# EAGLE schematic iot_demo_mote (EAGLE 6.5.0)
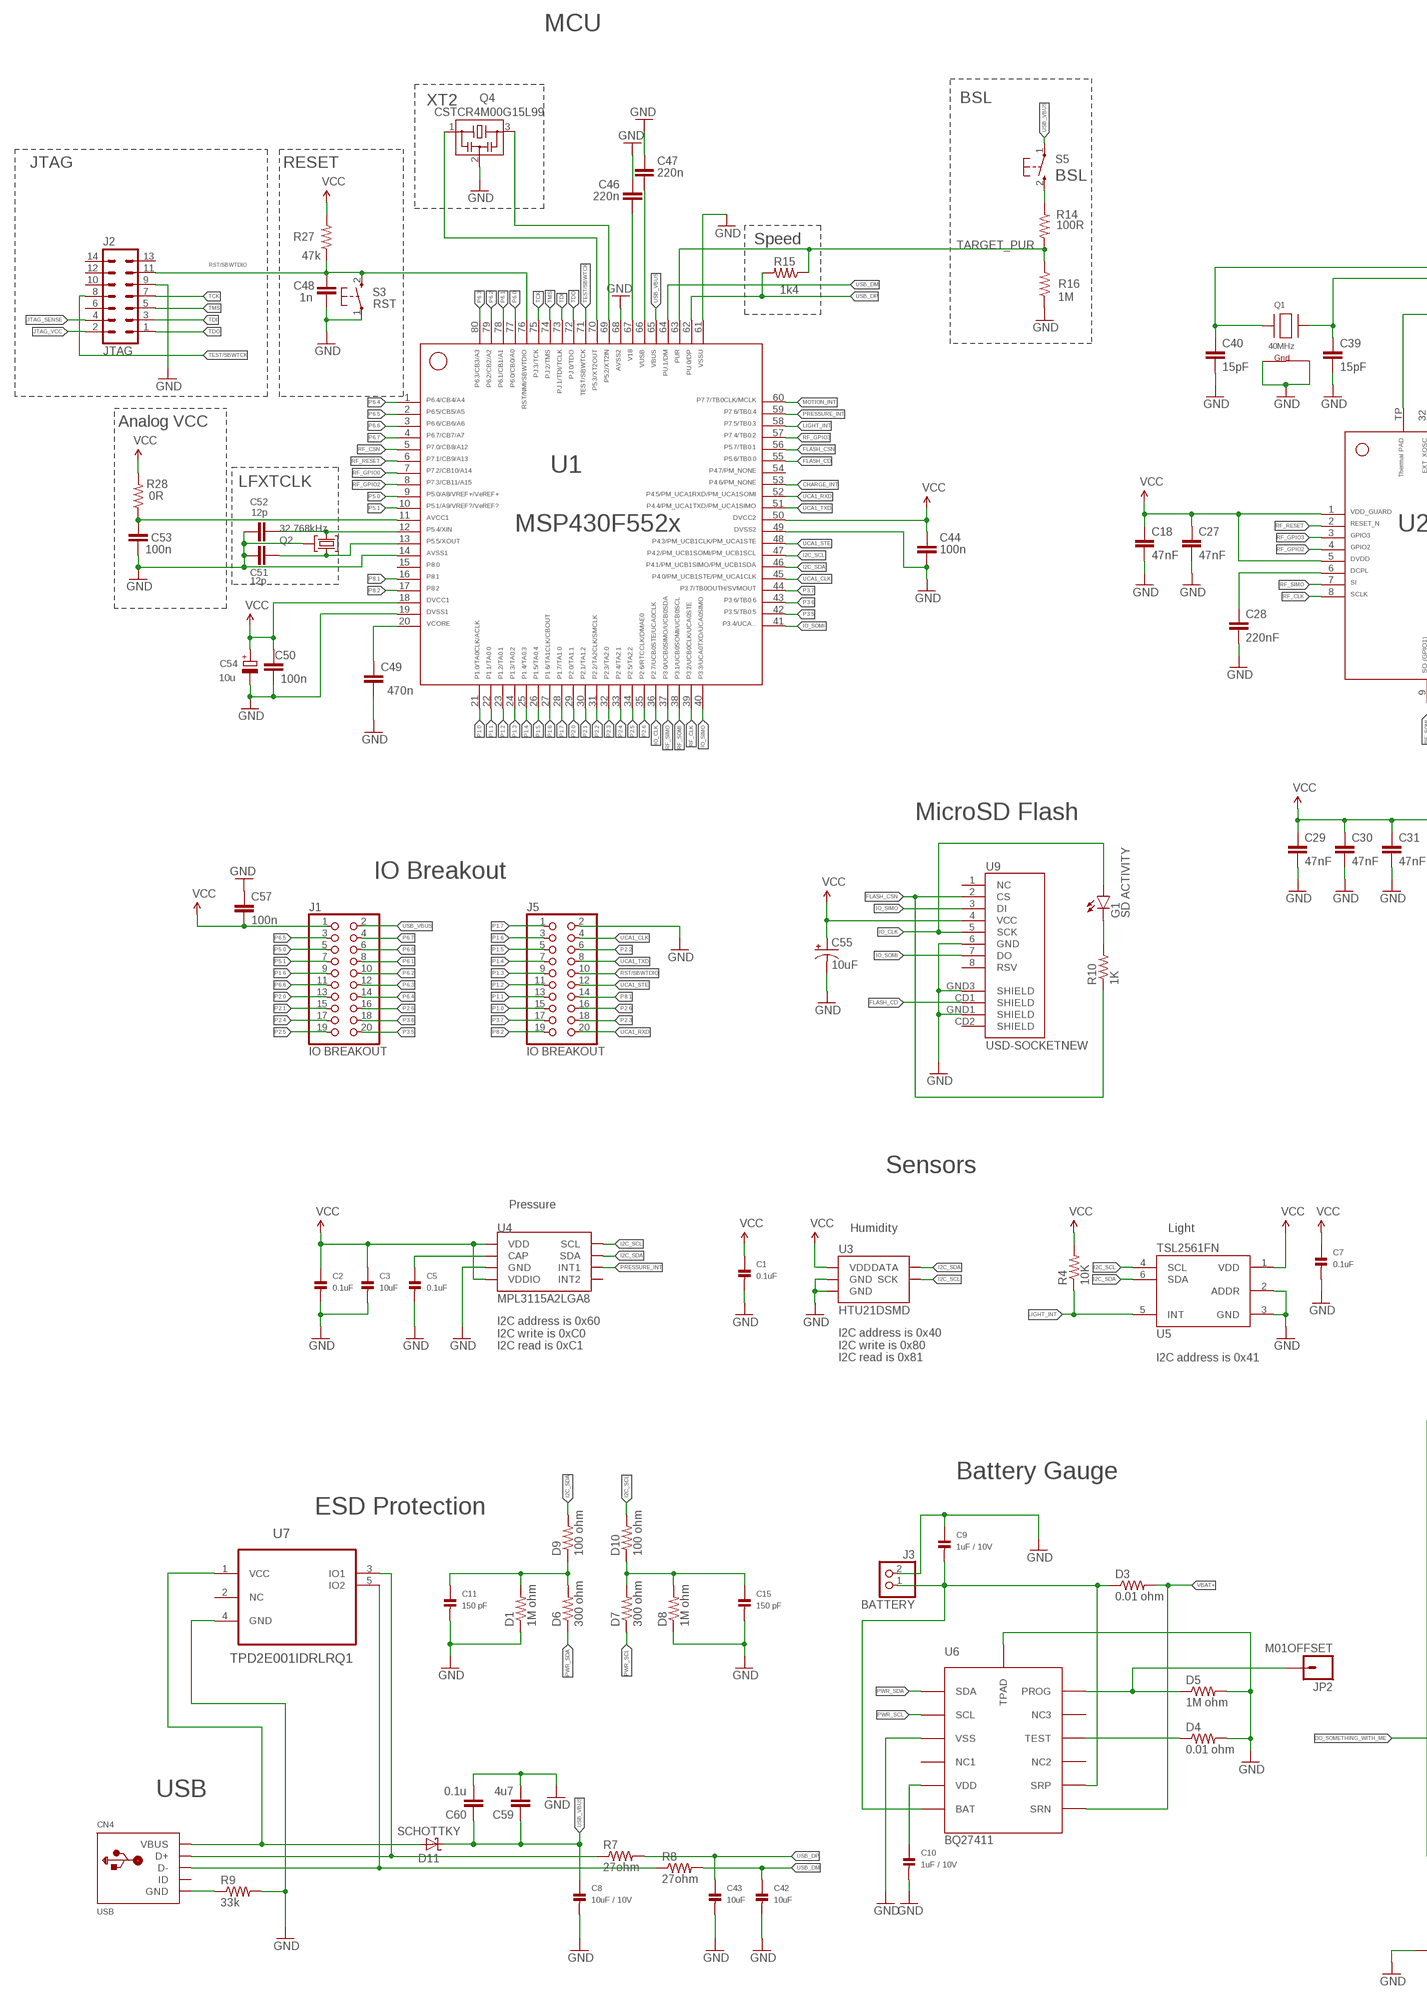
[diagram p0: schematic, sheet 1, part 1 of 2]
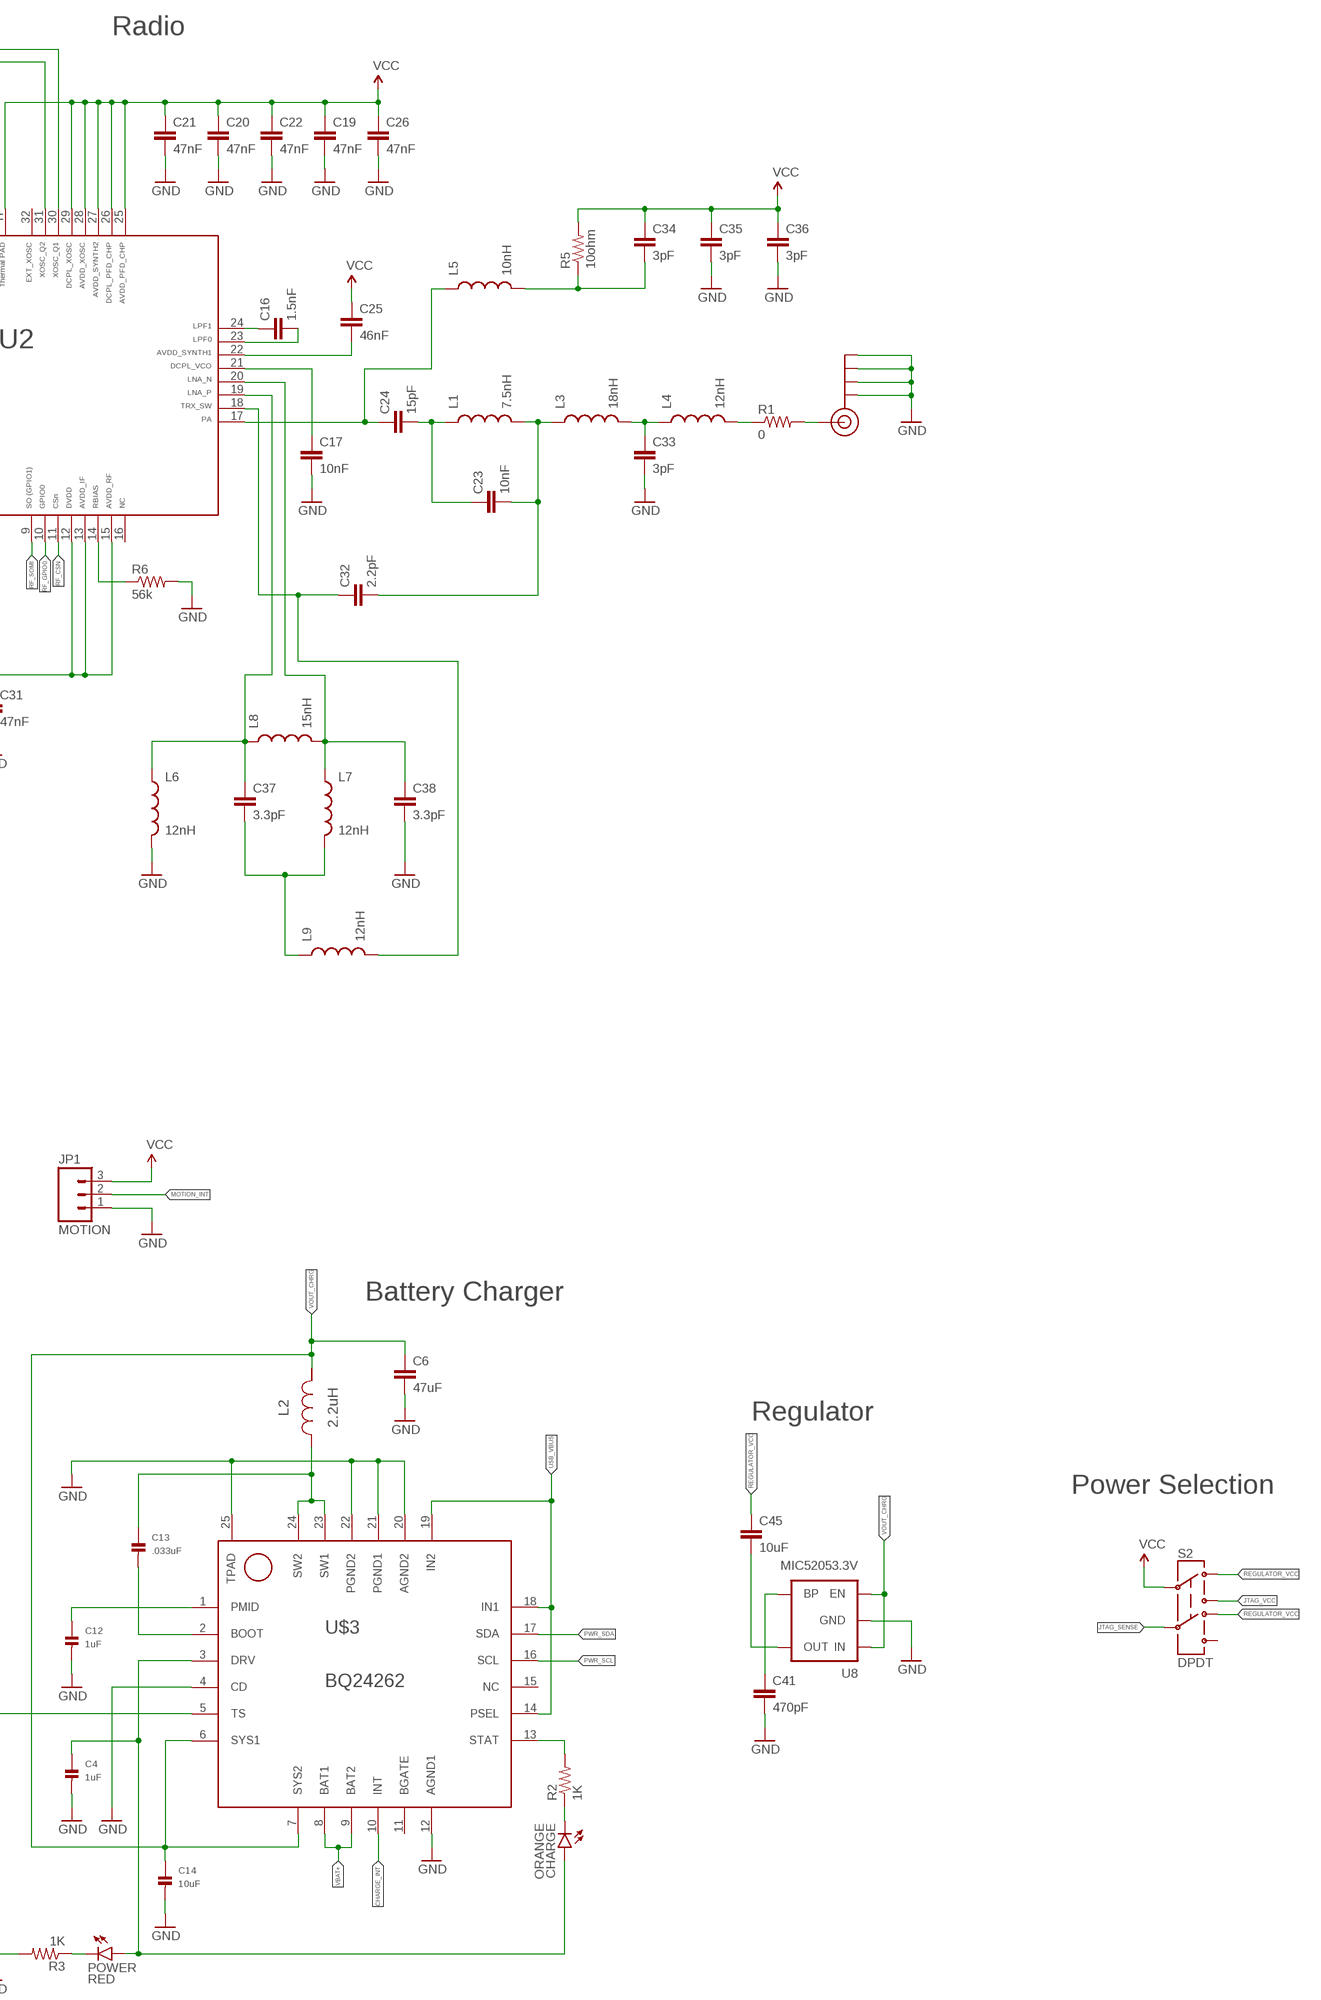
[diagram p1: schematic, sheet 1, part 2 of 2]

## Parts
C1  0.1uF  CAP_CERAMIC0603  [0603]
C2  0.1uF  CAP_CERAMIC0603  [0603]
C3  10uF  CAP_CERAMIC0603  [0603]
C4  1uF  CAP_CERAMIC0603  [0603]
C5  0.1uF  CAP_CERAMIC0603  [0603]
C6  47uF  CAP0402-CAP  [0402-CAP]
C7  0.1uF  CAP_CERAMIC0603  [0603]
C8  10uF / 10V  CAP_CERAMIC0603  [0603]
C9  1uF / 10V  CAP_CERAMIC0603  [0603]
C10  1uF / 10V  CAP_CERAMIC0603  [0603]
C11  150 pF  CAP_CERAMIC0603  [0603]
C12  1uF  CAP_CERAMIC0603  [0603]
C13  .033uF  CAP_CERAMIC0603  [0603]
C14  10uF  CAP_CERAMIC0603  [0603]
C15  150 pF  CAP_CERAMIC0603  [0603]
C16  1.5nF  CAP0402-CAP  [0402-CAP]
C17  10nF  CAP0402-CAP  [0402-CAP]
C18  47nF  CAP0402-CAP  [0402-CAP]
C19  47nF  CAP0402-CAP  [0402-CAP]
C20  47nF  CAP0402-CAP  [0402-CAP]
C21  47nF  CAP0402-CAP  [0402-CAP]
C22  47nF  CAP0402-CAP  [0402-CAP]
C23  10nF  CAP0402-CAP  [0402-CAP]
C24  15pF  CAP0402-CAP  [0402-CAP]
C25  46nF  CAP0402-CAP  [0402-CAP]
C26  47nF  CAP0402-CAP  [0402-CAP]
C27  47nF  CAP0402-CAP  [0402-CAP]
C28  220nF  CAP0402-CAP  [0402-CAP]
C29  47nF  CAP0402-CAP  [0402-CAP]
C30  47nF  CAP0402-CAP  [0402-CAP]
C31  47nF  CAP0402-CAP  [0402-CAP]
C32  2.2pF  CAP0402-CAP  [0402-CAP]
C33  3pF  CAP0402-CAP  [0402-CAP]
C34  3pF  CAP0402-CAP  [0402-CAP]
C35  3pF  CAP0402-CAP  [0402-CAP]
C36  3pF  CAP0402-CAP  [0402-CAP]
C37  3.3pF  CAP0402-CAP  [0402-CAP]
C38  3.3pF  CAP0402-CAP  [0402-CAP]
C39  15pF  CAP0402-CAP  [0402-CAP]
C40  15pF  CAP0402-CAP  [0402-CAP]
C41  470pF  CAP0402-CAP  [0402-CAP]
C42  10uF  CAP_CERAMIC0603  [0603]
C43  10uF  CAP_CERAMIC0603  [0603]
C44  100n  C-EUC0402  [C0402]
C45  10uF  CAP0402-CAP  [0402-CAP]
C46  220n  C-EUC0402  [C0402]
C47  220n  C-EUC0402  [C0402]
C48  1n  C-EUC0402  [C0402]
C49  470n  C-EUC0402  [C0402]
C50  100n  C-EUC0402  [C0402]
C51  12p  C-EUC0402  [C0402]
C52  12p  C-EUC0402  [C0402]
C53  100n  C-EUC0402  [C0402]
C54  10u  CPOL-EUA/3216-18R  [A/3216-18R]
C55  10uF  CPOL-USA/3216-18R  [A/3216-18R]
C57  100n  C-EUC0402  [C0402]
C59  4u7  C-EUC0603  [C0603]
C60  0.1u  C-EUC0603  [C0603]
CHARGE  ORANGE  LED0603  [LED-0603]
CN4  USB  USBMINIB  [USB-MINIB]
D1  1M ohm  R-US_R0402  [R0402]
D3  0.01 ohm  R-US_R0402  [R0402]
D4  0.01 ohm  R-US_R0402  [R0402]
D5  1M ohm  R-US_R0402  [R0402]
D6  300 ohm  R-US_R0402  [R0402]
D7  300 ohm  R-US_R0402  [R0402]
D8  1M ohm  R-US_R0402  [R0402]
D9  100 ohm  R-US_R0402  [R0402]
D10  100 ohm  R-US_R0402  [R0402]
D11  SCHOTTKY  SCHOTTKY-MINI-MELF  [MINIMELF]
G1  SD ACTIVITY  LED0603  [LED-0603]
J1  IO BREAKOUT  PINHD-2X10  [2X10]
J2  JTAG  ML14  [ML14]
J3  BATTERY  JST_2PIN-SMT-RA  [JST-PH-2-SMT-RA]
J5  IO BREAKOUT  PINHD-2X10  [2X10]
J$1  SMA_EDGE  [SMA-EDGE]
JP1  MOTION  M03JST-PTH-VERT  [JST-3-PTH-VERT]
JP2  M01OFFSET  [1X01_OFFSET]
L1  7.5nH  INDUCTOR0402  [C0402]
L2  2.2uH  SDR0403-2R2MLSDR0403-2R2ML  [SDR0403]
L3  18nH  INDUCTOR0402  [C0402]
L4  12nH  INDUCTOR0402  [C0402]
L5  10nH  INDUCTOR0402  [C0402]
L6  12nH  INDUCTOR0402  [C0402]
L7  12nH  INDUCTOR0402  [C0402]
L8  15nH  INDUCTOR0402  [C0402]
L9  12nH  INDUCTOR0402  [C0402]
POWER  RED  LED0603  [LED-0603]
Q1  40MHz  XTAL-4-3225  [NX3225]
Q2  32.768kHz  MS3V-T1R  [MS3V-T1R]
Q4  CSTCR4M00G15L99  MURATA-FILTER_CSTCR6M00G53Z  [MURATA-FILTER_CSTCR]
R1  0  RESISTOR0402-RES  [0402-RES]
R2  1K  R-US_R0402  [R0402]
R3  1K  R-US_R0402  [R0402]
R4  10K  R-US_R0402  [R0402]
R5  10ohm  RESISTOR0402-RES  [0402-RES]
R6  56k  RESISTOR0402-RES  [0402-RES]
R7  27ohm  RESISTOR0402-RES  [0402-RES]
R8  27ohm  RESISTOR0402-RES  [0402-RES]
R9  33k  RESISTOR0402-RES  [0402-RES]
R10  1K  RESISTOR0402-RES  [0402-RES]
R14  100R  R-US_R0402  [R0402]
R15  1k4  R-US_R0402  [R0402]
R16  1M  R-US_R0402  [R0402]
R27  47k  R-US_R0402  [R0402]
R28  0R  R-US_R0402  [R0402]
S2  DPDT  SWITCH-DPDTAYZ0202  [AYZ0202]
S3  RST  PB  [PBTH]
S5  BSL  PB  [PBTH]
U1  MSP430F5529IPNR  F552X---PN80  [PN80]
U2  CC1200  [RHB32]
U3  HTU21DSMD  [HTU21D]
U4  MPL3115A2LGA8  [LGA8]
U5  TSL2561FN  [FN-6]
U6  BQ27411  [VSON40P400X400X12]
U7  TPD2E001IDRLRQ1  [SOT50P160X60-5N]
U8  MIC52053.3V  [SOT23-5]
U9  USD-SOCKETNEW  [MICRO-SD-SOCKET-PP]
U$3  BQ24262  [QFN50P400X400X80-25N]

## Nets
AVCC [Power]: C53.1 R28.1 U1.11
BQ27411_BAT [Power]: C9.2 D3.1 J3.1 U6.P$6(BAT) U6.P$8(SRP)
CHARGE_INT: U1.53 U$3.10(INT)
DO_SOMETHING_WITH_ME: U$3.5(TS)
FLASH_CD: U1.55 U9.CD1(SHIELD)
FLASH_CSN: R10.1 U1.56 U9.2(CS)
GND: C1.2 C2.2 C3.2 C4.2 C5.2 C6.2 C7.2 C8.2 C9.1 C10.2 C11.2 C12.2 C14.2 C15.2 C17.2 C18.2 C19.2 C20.2 C21.2 C22.2 C26.2 C27.2 C28.2 C29.2 C30.2 C31.2 C33.2 C35.2 C36.2 C38.2 C39.2 C40.2 C41.2 C42.2 C43.2 C44.2 C46.2 C47.2 C48.2 C49.1 C50.1 C51.1 C52.1 C53.2 C54.- C55.- C57.1 C59.2 C60.2 D1.1 D4.2 D5.2 D8.1 J2.9 J3.2 J5.2 J$1.GND@0(GND) J$1.GND@1(GND) J$1.GND@2(GND) J$1.GND@3(GND) JP1.1 L6.2 Q1.2(G2) Q1.4(G1) Q2.P3(GND) Q4.2 R3.2 R6.2 R9.2 R16.1 S3.1(P) U1.14 U1.19 U1.49 U1.61 U1.68 U3.7(GND) U3.GND U4.3(GND) U5.2(ADDR) U5.3(GND) U6.P$3(VSS) U6.P$13(TPAD) U7.4(GND) U8.2(GND) U9.6(GND) U9.GND1(SHIELD) U9.GND3(SHIELD) U$3.4(CD) U$3.12(AGND1) U$3.20(AGND2) U$3.21(PGND1) U$3.22(PGND2) U$3.25(TPAD)
I2C_SCL: D10.2 U1.47 U3.SCK U4.8(SCL) U5.4(SCL)
I2C_SDA: D9.2 U1.46 U3.DATA U4.7(SDA) U5.6(SDA)
IO_CLK: G1.A U1.36 U9.5(SCK)
IO_SIMO: U1.40 U9.3(DI)
IO_SOMI: U1.41 U9.7(DO)
JTAG_SENSE: J2.4 S2.5
JTAG_VCC: J2.2 S2.3
LIGHT_INT: R4.1 U1.58 U5.5(INT)
MOTION_INT: JP1.2 U1.60
N$1: C5.1 U4.2(CAP)
N$2: C4.1 CHARGE.A POWER.A U$3.3(DRV)
N$4: C24.1 L5.1 U2.17
N$5: CHARGE.C R2.1
N$6: R2.2 U$3.13(STAT)
N$7: C12.1 U$3.1(PMID)
N$8: POWER.C R3.1
N$9: C16.2 U2.23
N$10: C15.1 D7.2 D8.2 D10.1
N$11: C10.1 U6.P$5(VDD)
N$12: D4.1 U6.P$10(TEST)
N$13: C16.1 U2.24
N$14: C11.1 D1.2 D6.2 D9.1
N$15: D5.1 JP2.1 U6.P$12(PROG)
N$16: C17.1 U2.21
N$17: C23.1 C24.2 L1.1
N$18: C28.1 U2.6
N$19: C13.1 L2.2 U$3.23(SW1) U$3.24(SW2)
N$20: C23.2 C32.2 L1.2 L3.1
N$21: C13.2 U$3.2(BOOT)
N$22: L4.2 R1.1
N$23: C32.1 L9.2 U2.18
N$24: C25.2 U2.22
N$25: J$1.SIG(SIGNAL) R1.2
N$26: C33.1 L3.2 L4.1
N$27 [Ground]: CN4.GND R9.1
N$28: C34.2 L5.2 R5.1
N$30: C40.1 Q1.1(X1) U2.30
N$31: C37.1 L6.1 L8.1 U2.19
N$32: C38.1 L7.1 L8.2 U2.20
N$33: C39.1 Q1.3(X2) U2.31
N$34: C45.2 U8.5(OUT)
N$35: C37.2 L7.2 L9.1
N$36 [Power]: CN4.VBUS D11.A U7.1(VCC)
N$37: R6.1 U2.14
N$38: R14.1 S5.2(S)
N$40: C41.1 U8.4(BP)
N$42: G1.C R10.2
P1.0: J5.15 U1.21
P1.1: J5.13 U1.22
P1.2: J5.11 U1.23
P1.3: J5.9 U1.24
P1.4: J5.7 U1.25
P1.5: J5.5 U1.26
P1.6: J1.9 J5.3 U1.27
P1.7: J5.1 U1.28
P2.0: J1.13 U1.29
P2.1: J1.15 U1.30
P2.2: J5.6 U1.31
P2.3: J5.18 U1.32
P2.4: J1.17 U1.33
P2.5: J1.19 U1.34
P2.6: J1.16 J5.16 U1.35
P3.5: J1.20 U1.42
P3.6: J1.18 U1.43
P3.7: J5.17 U1.44
P5.0: J1.5 U1.9
P5.1: J1.7 U1.10
P5.2/XT2IN: Q4.3 U1.69
P5.3/XT2OUT: Q4.1 U1.70
P5.4/XIN: C52.2 Q2.P2 U1.12
P5.5/XOUT: C51.2 Q2.P1 U1.13
P6.0: J1.6 U1.77
P6.1: J1.8 U1.78
P6.2: J1.10 U1.79
P6.3: J1.12 U1.80
P6.4: J1.14 U1.1
P6.5: J1.3 U1.2
P6.6: J1.11 U1.3
P6.7: J1.4 U1.4
P8.1: J5.14 U1.16
P8.2: J5.19 U1.17
PRESSURE_INT: U1.59 U4.6(INT1)
PWR_SCL: D7.1 U6.P$2(SCL) U$3.16(SCL)
PWR_SDA: D6.1 U6.P$1(SDA) U$3.17(SDA)
REGULATOR_VCC: C45.1 S2.1 S2.4
RF_CLK: U1.39 U2.8
RF_CSN: U1.5 U2.11
RF_GPIO0: U1.7 U2.10
RF_GPIO2: U1.8 U2.4
RF_GPIO3: U1.57 U2.3
RF_RESET: U1.6 U2.2
RF_SIMO: U1.37 U2.7
RF_SOMI: U1.38 U2.9
RST/SBWTDIO: C48.1 J2.11 J5.10 R27.1 S3.2(S) U1.76
TARGET_PUR: R14.2 R15.1 R16.2 U1.63
TARGET_VUSB [Power]: C47.1 U1.66
TCK: J2.7 U1.75
TDI: J2.3 U1.73
TDO: J2.1 U1.72
TEST/SBWTCK: J2.8 U1.71
TMS: J2.5 U1.74
UCA1_CLK: J5.4 U1.45
UCA1_RXD: J5.20 U1.52
UCA1_STE: J5.12 U1.48
UCA1_TXD: J5.8 U1.51
USB_D+: CN4.D+ R7.1 U7.3(IO1)
USB_D-: CN4.D- R8.1 U7.5(IO2)
USB_DM: C42.1 R8.2 U1.64
USB_DP: C43.1 R7.2 R15.2 U1.62
USB_VBUS: C8.1 C59.1 C60.1 D11.C J1.2 S5.1(P) U1.65 U$3.14(PSEL) U$3.18(IN1) U$3.19(IN2)
V18 [Power]: C46.1 U1.67
VBAT+: D3.2 U6.P$7(SRN) U$3.8(BAT1) U$3.9(BAT2)
VCC [Power]: C1.1 C2.1 C3.1 C7.1 C18.1 C19.1 C20.1 C21.1 C22.1 C25.1 C26.1 C27.1 C29.1 C30.1 C31.1 C34.1 C35.1 C36.1 C44.1 C50.2 C54.+ C55.+ C57.2 J1.1 JP1.3 R4.2 R5.2 R27.2 R28.2 S2.2 U1.18 U1.50 U2.1 U2.5 U2.12 U2.13 U2.15 U2.25 U2.26 U2.27 U2.28 U2.29 U2.TP U3.VDD U4.1(VDD) U4.4(VDDIO) U5.1(VDD) U9.4(VCC)
VCORE [Power]: C49.2 U1.20
VOUT_CHRG: C6.1 C14.1 L2.1 U8.1(IN) U8.3(EN) U$3.6(SYS1) U$3.7(SYS2)
Unconnected: CN4.ID J2.6 J2.10 J2.12 J2.13 J2.14 S2.6 U1.15 U1.54 U2.16 U2.32 U4.5(INT2) U6.P$4(NC1) U6.P$9(NC2) U6.P$11(NC3) U7.2(NC) U9.1(NC) U9.8(RSV) U9.CD2(SHIELD) U$3.11(BGATE) U$3.15(NC)

## Notes on the sheet
- MCU
- XT2 | BSL
- JTAG | RESET
- Speed
- Radio
- Analog VCC
- /Users/mstump/Downloads/datastax_logo_black.bmp
- LFXTCLK
- MicroSD Flash
- IO Breakout
- Sensors
- Pressure
- Humidity | Light
- I2C address is 0x60
  I2C write is 0xC0
  I2C read is 0xC1
- I2C address is 0x40
  I2C write is 0x80
  I2C read is 0x81
- I2C address is 0x41
- Battery Charger
- Battery Gauge | Regulator
- ESD Protection
- Power Selection
- USB

## Library data of the parts
C1 C2 C5 C7 = microbuilder:CAP_CERAMIC: Ceramic Capacitors 0402 - 0402 Surface Mount Capacitors 16pF 50V 5% [Digikey: 445-4899-2-ND] 18pF 50V 5% [Digikey: 490-1281-2-ND] 22pF 50V 5% [Digikey: 490-1283-2-ND] 68pF 50V 5% [Digikey: 490-1289-2-ND] 0.1uF 10V 10% [Digikey: 490-1318-2-ND] 1.0uF 6.3V 10% [Digikey: 490-1320-2-ND] 0603 - 0603 Surface Mount Capacitors 16 pF 50V 5% [Digikey: 445-5051-2-ND] 22 pF 50V [Digikey: PCC220ACVTR-ND] 33 pF 50V 5% [Digikey: 490-1415-1-ND] 56pF 50V 5% [Digikey: 490-1421-1-ND] 220pF 50V 5% [Digikey: 445-1285-1-ND] 680 pF 50V 2200 pF 50V 5% C0G [Digikey: 445-1297-1-ND] 5600 pF 100V 5% X7R [Digikey: 478-3711-1-ND] 0.1 µF 25V 10% [Digikey: PCC2277TR-ND] 0.22 µF 16V 10% X7R [Digikey: 445-1318-1-ND] 1.0 µF 25V 10% [Digikey: 445-5146-2-ND] 0603 - RF Specific 3pF 250V +/-0.1pF RF [Digikey: 712-1347-1-ND] 18 pF 250V 5% [Digikey: 478-3505-1-ND or 712-1322-1-ND] 56 pF 250V 5% C0G RF [Digikey: 490-4867-1-ND] 68 pF 250V RF [Digikey: 490-4868-1-ND] 0805 - 0805 Surface Mount Capacitors 220 pF 250V 2% RF Ceramic Capacitor [Digikey: 712-1398-1-ND] 1000 pF 50V 2% NP0 Ceramic Capacitor [Digikey: 478-3760-1-ND] 0.1 µF 25V 10% Ceramic Capacitor [Digikey: PCC1828TR-ND] 1.0 µF 16V 10% Ceramic Capacitor[Digikey: 490-1691-2-ND] 10.0 µF 10V 10% Ceramic Capacitor[Digikey: 709-1228-1-ND] 10.0 uF 16V 10% Ceramic Capacitor [Digikey: 478-5165-2-ND] 47 uF 6.3V 20% Ceramic Capacitor [Digikey: 587-1779-1-ND or 399-5506-1-ND] 1206 - 1206 Surface Mount Capacitors 47uF 10V 20% Ceramic Capacitor [Digikey: 490-5528-1-ND or 399-5508-1-ND or 445-6010-1-ND] 100uF 6.3V -20%, +80% Y5V Ceramic Capacitor (Digikey: 490-4512-1-ND, Mouser: 81-GRM31CF50J107ZE1L); MPN: 0603YC104JAT2A; OC_NEWARK: 96M1175
C3 C4 C8-C15 C42 C43 = microbuilder:CAP_CERAMIC: Ceramic Capacitors 0402 - 0402 Surface Mount Capacitors 16pF 50V 5% [Digikey: 445-4899-2-ND] 18pF 50V 5% [Digikey: 490-1281-2-ND] 22pF 50V 5% [Digikey: 490-1283-2-ND] 68pF 50V 5% [Digikey: 490-1289-2-ND] 0.1uF 10V 10% [Digikey: 490-1318-2-ND] 1.0uF 6.3V 10% [Digikey: 490-1320-2-ND] 0603 - 0603 Surface Mount Capacitors 16 pF 50V 5% [Digikey: 445-5051-2-ND] 22 pF 50V [Digikey: PCC220ACVTR-ND] 33 pF 50V 5% [Digikey: 490-1415-1-ND] 56pF 50V 5% [Digikey: 490-1421-1-ND] 220pF 50V 5% [Digikey: 445-1285-1-ND] 680 pF 50V 2200 pF 50V 5% C0G [Digikey: 445-1297-1-ND] 5600 pF 100V 5% X7R [Digikey: 478-3711-1-ND] 0.1 µF 25V 10% [Digikey: PCC2277TR-ND] 0.22 µF 16V 10% X7R [Digikey: 445-1318-1-ND] 1.0 µF 25V 10% [Digikey: 445-5146-2-ND] 0603 - RF Specific 3pF 250V +/-0.1pF RF [Digikey: 712-1347-1-ND] 18 pF 250V 5% [Digikey: 478-3505-1-ND or 712-1322-1-ND] 56 pF 250V 5% C0G RF [Digikey: 490-4867-1-ND] 68 pF 250V RF [Digikey: 490-4868-1-ND] 0805 - 0805 Surface Mount Capacitors 220 pF 250V 2% RF Ceramic Capacitor [Digikey: 712-1398-1-ND] 1000 pF 50V 2% NP0 Ceramic Capacitor [Digikey: 478-3760-1-ND] 0.1 µF 25V 10% Ceramic Capacitor [Digikey: PCC1828TR-ND] 1.0 µF 16V 10% Ceramic Capacitor[Digikey: 490-1691-2-ND] 10.0 µF 10V 10% Ceramic Capacitor[Digikey: 709-1228-1-ND] 10.0 uF 16V 10% Ceramic Capacitor [Digikey: 478-5165-2-ND] 47 uF 6.3V 20% Ceramic Capacitor [Digikey: 587-1779-1-ND or 399-5506-1-ND] 1206 - 1206 Surface Mount Capacitors 47uF 10V 20% Ceramic Capacitor [Digikey: 490-5528-1-ND or 399-5508-1-ND or 445-6010-1-ND] 100uF 6.3V -20%, +80% Y5V Ceramic Capacitor (Digikey: 490-4512-1-ND, Mouser: 81-GRM31CF50J107ZE1L); MPN: 06035A100FAT2A; OC_NEWARK: 43T7237
C6 C41 C45 = SparkFun-Capacitors:CAP: Capacitor Standard 0603 ceramic capacitor, and 0.1" leaded capacitor.; MPN: 06035A100FAT2A; OC_NEWARK: 43T7237
C16-C40 = SparkFun-Capacitors:CAP: Capacitor Standard 0603 ceramic capacitor, and 0.1" leaded capacitor.; MPN: 0603YC104JAT2A; OC_NEWARK: 96M1175
C44 C46-C53 C57 C59 C60 = rcl:C-EU: CAPACITOR, European symbol
C54 = rcl:CPOL-EU: POLARIZED CAPACITOR, European symbol
C55 = adafruit:CPOL-US: POLARIZED CAPACITOR, American symbol
CHARGE G1 POWER = SparkFun-LED:LED: LEDs Standard schematic elements and footprints for 5mm, 3mm, 1206, and 0603 sized LEDs. 5mm - Spark Fun Electronics SKU : COM-00529 (and others)
CN4 = adafruit:USB: USB Connectors USBMINIB - Surface Mount Female Mini-B USB Connector 4UConnector: 06564 By microbuilder.eu Thru-hole RA Female Mini-B USB Connector 4UConnector: 18732 By ladyada.net
D1 D3-D10 R2 R3 R14-R16 R27 R28 = adafruit:R-US_: RESISTOR, American symbol
D11 = diode:SCHOTTKY-MINI-MELF
J1 J5 = pinhead:PINHD-2X10: PIN HEADER
J2 = CON-ML:ML14: HARTING
J3 = adafruit:JST_2PIN: JST 2-Pin Connectors of various flavors SMT-RA (S2B-PH-SM4) 4UConnector #17311 SMT (B2B-PH-SM4) THM-RA (S2B-PH) THM (B2B-PH)
J$1 = SparkFun-Connectors:SMA_EDGE: SMA Antenna Connector End launch SMA connector. The paste layer has been removed so that the connector can be hand soldered onto the board after reflow.
JP1 = SparkFun-Connectors:M03: Header 3 Standard 3-pin 0.1" header. Use with straight break away headers (SKU : PRT-00116), right angle break away headers (PRT-00553), swiss pins (PRT-00743), machine pins (PRT-00117), and female headers (PRT-00115). Molex polarized connector foot print use with SKU : PRT-08232 with associated crimp pins and housings.
JP2 = SparkFun-Connectors:M01: Header 1 Standard 1-pin 0.1" header. Use with straight break away headers (SKU : PRT-00116), right angle break away headers (PRT-00553), swiss pins (PRT-00743), machine pins (PRT-00117), and female headers (PRT-00115).
L1 L3-L9 = SparkFun-Passives:INDUCTOR: Inductors Basic Inductor/Choke - 0603 and 1206. Footprints are not proven and vary greatly between part numbers. SRN6045- 33uH, 20% 1.4A SDR0403-560KL - 56uH, 10%, 500mA RMS/740mA peak
L2 = AcceleratedDesigns_Lib:SDR0403-2R2ML; DCR: 0.047; IDC: 2.6; L: 2.2E-6; MANUFACTURER_NAME: Bourns; MANUFACTURER_PART_NUMBER: SDR0403-2R2ML; VENDOR: Bourns
Q1 = adafruit:XTAL-4: Classic 4-pin 3.2 x 2.5mm crystal
Q2 = microcrystal:MS3V-T1R
Q4 = murata:MURATA-FILTER_CSTCR: Resonator Source: murata.co.jp; MPN: CSTCR6M00G53-R0; OC_FARNELL: 1170434; OC_NEWARK: 25M8759
R1 R5-R10 = SparkFun-Passives:RESISTOR: Resistor Basic schematic elements and footprints for 0603, 1206, and PTH resistors.
R4 = adafruit:R-US_: RESISTOR, American symbol; MPN: ERJ-P03F1002V; OC_NEWARK: 32R9341
S2 = SparkFun-Electromechanical:SWITCH-DPDT: DPDT Version of the COM-00597; PROD_ID: SWCH-08179
S3 S5 = electricalmeter:PB: OMRON SWITCH
U1 = TI_MSP430_v16_intern:F552X---PN80: ***MSP430F552X***PN80 http://www.ti.com/lit/gpn/msp430f5529 Rev1.0 06/2010 For F552X where X is 1,5,7,9
U2 = iot_demo_hardware:CC1200: CC1200
U3 = SparkFun-Sensors:HTU21D; MPN: HTU21D; OC_NEWARK: 37X5938
U4 = SparkFun-Sensors:MPL3115A2: Altimeter/Pressure Sensor, I2C, 1.95V-3.6V supply, 50 to 110kPa; MPN: MPL3115A2; OC_NEWARK: 48T4344
U5 = mike-temp:TSL2561: TSL2561 illumination sensor Approximates Human Eye Response Precisely Measures Illuminance Programmable Interrupt Function with User-Defined Upper and Lower Threshold 400 KHz I2C interface Programmable Analog Gain and Integration Time Supporting 1,000,000-to-1 Dynamic Range Automatically Rejects 50/60-Hz Lighting Ripple Low Active Power (0.75 mW Typical) with Power Down Mode RoHS Compliant The TSL2561 is a light-to-digital converter that transform light intensity to a digital signal output via I2C interface. The device combines one broadband photodiode (visible plus infrared) and one infrared-responding photodiode on a single CMOS integrated circuit capable of providing a near-photopic response over an effective 20-bit dynamic range (16-bit resolution). Two integrating ADCs convert the photodiode currents to a digital output that represents the irradiance measured on each channel. This digital output can be input to a microprocessor where illuminance (ambient light level) in lux is derived using an empirical formula to approximate the human eye response. The TSL2561 device supports a traditional level style interrupt that remains asserted until the firmware clears it.; MPN: TSL2561T; OC_NEWARK: 05M1632
U6 = iot_demo_hardware:BQ27411
U7 = Texas Instruments_By_element14_Batch_1:TPD2E001IDRLRQ1: LOW-CAPACITANCE 2-CHANNEL ±15-kV ESD-PROTECTION ARRAY; MPN: TPD2E001IDRLRQ1; OC_FARNELL: -; OC_NEWARK: 55R7553; PACKAGE: SOT-23-5; SUPPLIER: Texas Instruments
U8 = SparkFun-PowerIC:MIC5205: MIC5205 150mA vreg 3.3V - VREG-00822 5V - VREG-00823; PROD_ID: VREG-00822
U9 = SparkFun-Connectors:USD-SOCKET: microSD Socket Push-push type uSD socket. Schematic element and footprint production proven. Spark Fun Electronics SKU : PRT-00127. tDoc lines correctly indicate media card edge positions when inserting (unlocked, locked, depressed).
U$3 = iot_demo_hardware:BQ24262

## Net classes
1 Ground: width 0.305 mm, drill 0.305 mm, clearance 0.152 mm to class 0, clearance 0.152 mm
2 Power: width 0.406 mm, drill 0.305 mm, clearance 0.152 mm to class 0, clearance 0.152 mm to class 1, clearance 0.152 mm